# Altium schematic sheet 09)ENET.SchDoc
size 297 x 209 mm
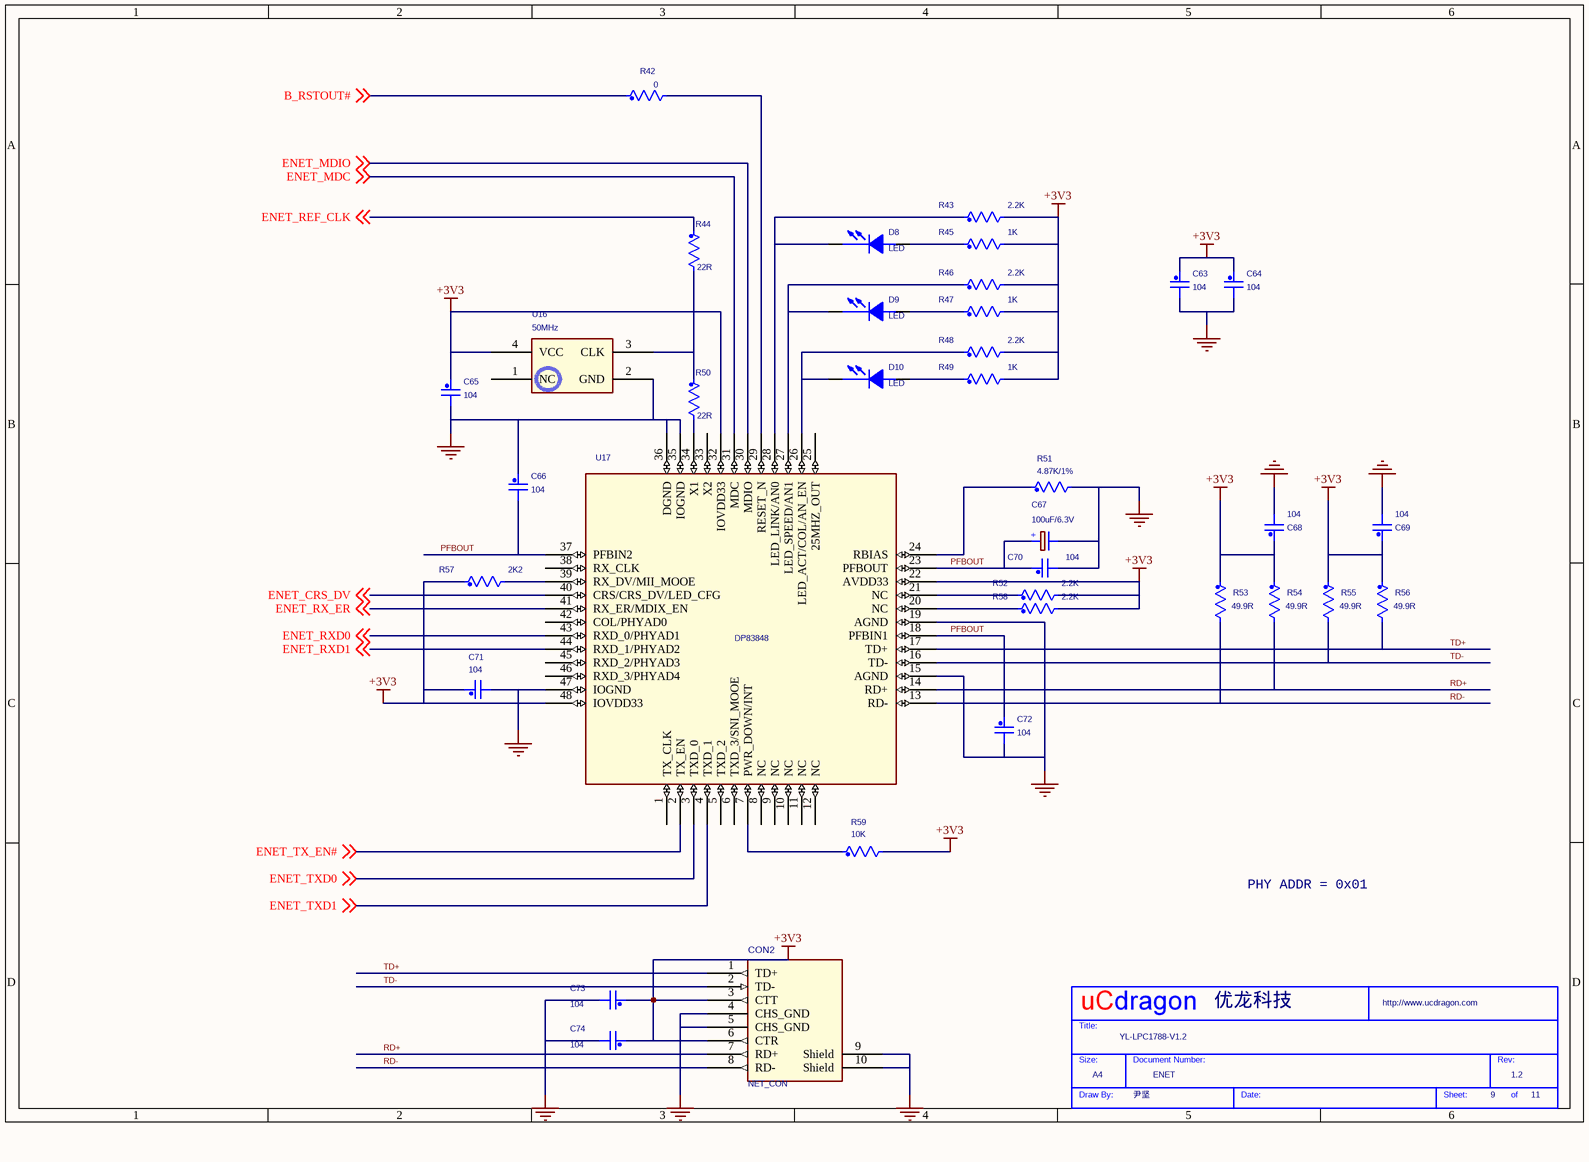
[diagram p0: 09)ENET.SchDoc]

## Parts
*  Page Count: 11  Page Number: 9  Page Size: A4  Title: YL-LPC1788-V1.2  RevCode: 1.2  Doc: ENET  Drawing: 尹坚  Company: 优龙科技  (hidden comment: My Title 0)  (graphical)
C63  104  [CAP0805]
C64  104  [CAP0805]
C65  104  [CAP0805]
C66  104  [CAP0805]
C67  100uF/6.3V  [TAN-B]
C68  104  [CAP0805]
C69  104  [CAP0805]
C70  104  [CAP0805]
C71  104  [CAP0805]
C72  104  [CAP0805]
C73  104  [CAP0805]
C74  104  [CAP0805]
CON2  NET_CON  [RJ-45B]
D8  LED  [LED3]
D9  LED  [LED3]
D10  LED  [LED3]
R42  0  [RES0805]
R43  2.2K  [RES0805]
R44  22R  [RES0805]
R45  1K  [RES0805]
R46  2.2K  [RES0805]
R47  1K  [RES0805]
R48  2.2K  [RES0805]
R49  1K  [RES0805]
R50  22R  [RES0805]
R51  4.87K/1%  [RES0805]
R52  2.2K  [RES0805]
R53  49.9R  [RES0805]
R54  49.9R  [RES0805]
R55  49.9R  [RES0805]
R56  49.9R  [RES0805]
R57  2K2  [RES0805]
R58  2.2K  [RES0805]
R59  10K  [RES0805]
U16  50MHz  [XTAL6]
U17  DP83848  [DP83848]

## Nets
+3V3: C63.1 C64.1 C65.1 C68.1 C69.1 C71.1 C73.1 C74.1 CON2.3(CTT) CON2.6(CTR) R43.2 R45.2 R46.2 R47.2 R48.2 R49.2 R52.2 R53.1 R54.1 R55.1 R56.1 R57.1 R58.2 R59.2 U16.4(VCC) U17.22(AVDD33) U17.32(IOVDD33) U17.48(IOVDD33)
GND_POWER: C63.2 C64.2 C65.2 C66.1 C67.2 C68.2 C69.2 C70.2 C71.2 C72.2 C73.2 C74.2 CON2.4(CHS_GND) CON2.5(CHS_GND) CON2.9(Shield) CON2.10(Shield) R51.2 U16.2(GND) U17.15(AGND) U17.19(AGND) U17.35(IOGND) U17.36(DGND) U17.47(IOGND)
B_RSTOUT#: R42.1 ; off-sheet B_RSTOUT#
ENET_CRS_DV: U17.40(CRS/CRS_DV/LED_CFG) ; off-sheet ENET_CRS_DV
ENET_MDC: U17.31(MDC) ; off-sheet ENET_MDC
ENET_MDIO: U17.30(MDIO) ; off-sheet ENET_MDIO
ENET_REF_CLK: R44.1 ; off-sheet ENET_REF_CLK
ENET_RX_ER: U17.41(RX_ER/MDIX_EN) ; off-sheet ENET_RX_ER
ENET_RXD0: U17.43(RXD_0/PHYAD1) ; off-sheet ENET_RXD0
ENET_RXD1: U17.44(RXD_1/PHYAD2) ; off-sheet ENET_RXD1
ENET_TX_EN#: U17.2(TX_EN) ; off-sheet ENET_TX_EN#
ENET_TXD0: U17.3(TXD_0) ; off-sheet ENET_TXD0
ENET_TXD1: U17.4(TXD_1) ; off-sheet ENET_TXD1
PFBOUT: C66.2 C67.1 C70.1 C72.1 U17.18(PFBIN1) U17.23(PFBOUT) U17.37(PFBIN2)
RD+: CON2.7(RD+) R54.2 U17.14(RD+)
RD-: CON2.8(RD-) R53.2 U17.13(RD-)
TD+: CON2.1(TD+) R56.2 U17.17(TD+)
TD-: CON2.2(TD-) R55.2 U17.16(TD-)
NetD8_1: D8.1(ANODE) R45.1
NetD8_2: D8.2(CATHODE) R43.1 U17.28(LED_LINK/AN0)
NetD9_1: D9.1(ANODE) R47.1
NetD9_2: D9.2(CATHODE) R46.1 U17.27(LED_SPEED/AN1)
NetD10_1: D10.1(ANODE) R49.1
NetD10_2: D10.2(CATHODE) R48.1 U17.26(LED_ACT/COL/AN_EN)
NetR42_2: R42.2 U17.29(RESET_N)
NetR44_2: R44.2 R50.1 U16.3(CLK)
NetR50_2: R50.2 U17.34(X1)
NetR51_1: R51.1 U17.24(RBIAS)
NetR52_1: R52.1 U17.21(NC)
NetR57_2: R57.2 U17.39(RX_DV/MII_MOOE)
NetR58_1: R58.1 U17.20(NC)
NetR59_1: R59.1 U17.7(PWR_DOWN/INT)

Not connected (* = marked no-connect by the designer): U16 1(NC); U17 1(TX_CLK) 5(TXD_2) 6(TXD_3/SNI_MOOE) 8(NC) 9(NC) 10(NC) 11(NC) 12(NC) 25(25MHZ_OUT) 33(X2) 38(RX_CLK) 42(COL/PHYAD0) 45(RXD_2/PHYAD3) 46(RXD_3/PHYAD4)

## Notes on the sheet
- PHY ADDR = 0x01
- (in symbol CAP PN_Dup1) +
- (in symbol My Title 0) Title:; Size:; Document Number:; Rev:; Draw By:; Date:; Sheet:; of

## Library data of the parts
C63-C66 C68-C74 = C_Generic_Dup1: Dielectric: X7R; Mfg #1: KEMET; Voltage: 16V; P/N #1: C0603C104K4RAC; Toler.: 10%
C67 = CAP PN_Dup1: SDTSourceLibName: C:\WINDOWS\TEMP\SNDS.LIB
CON2 = Single_Ports_Combo_3
D8-D10 = LED_Dup1
R42-R59 = R_Generic_Dup1: Toler.: 1%; Watts: 0.1W; P/N #1: CR10-1001F-T; Mfg #1: AVX
U16 = XTAL2_2
* = My Title 0: Page Create Date: May 29, 2006; WebSite: http://www.ucdragon.com